# EasyEDA Pro project PCBLayout.epro

# Board PCB1
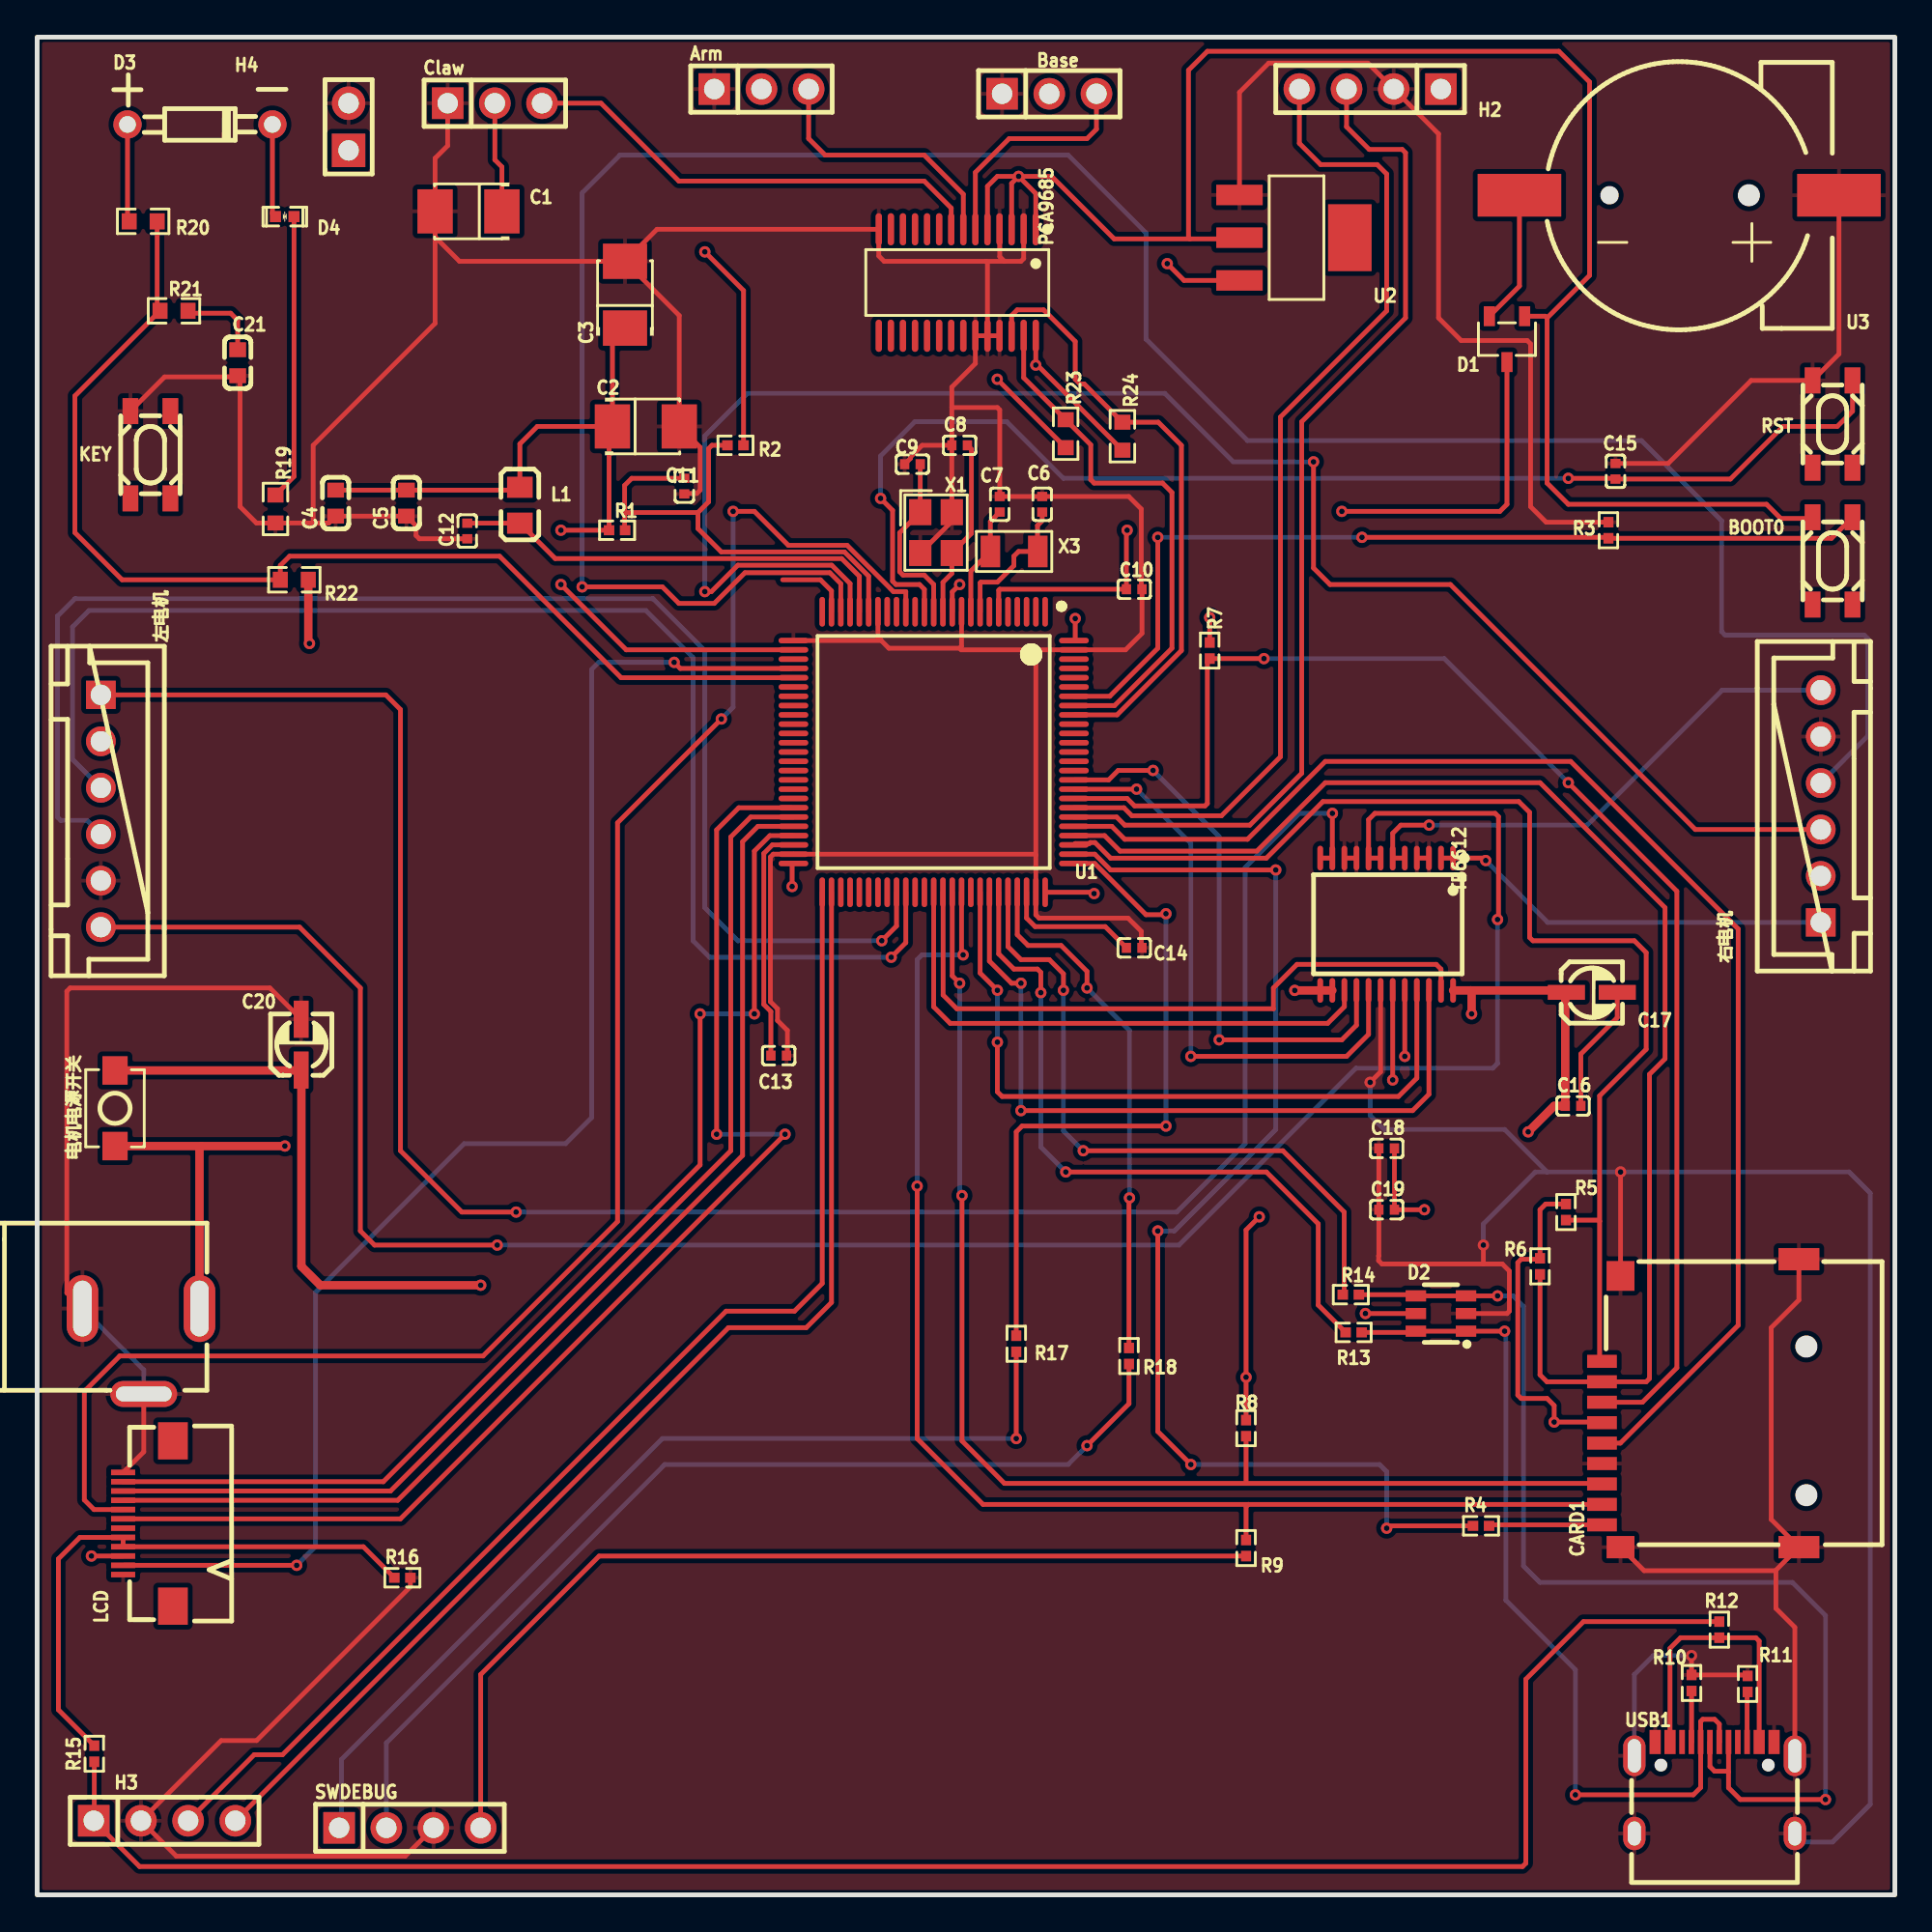
[diagram p0: board, top side]
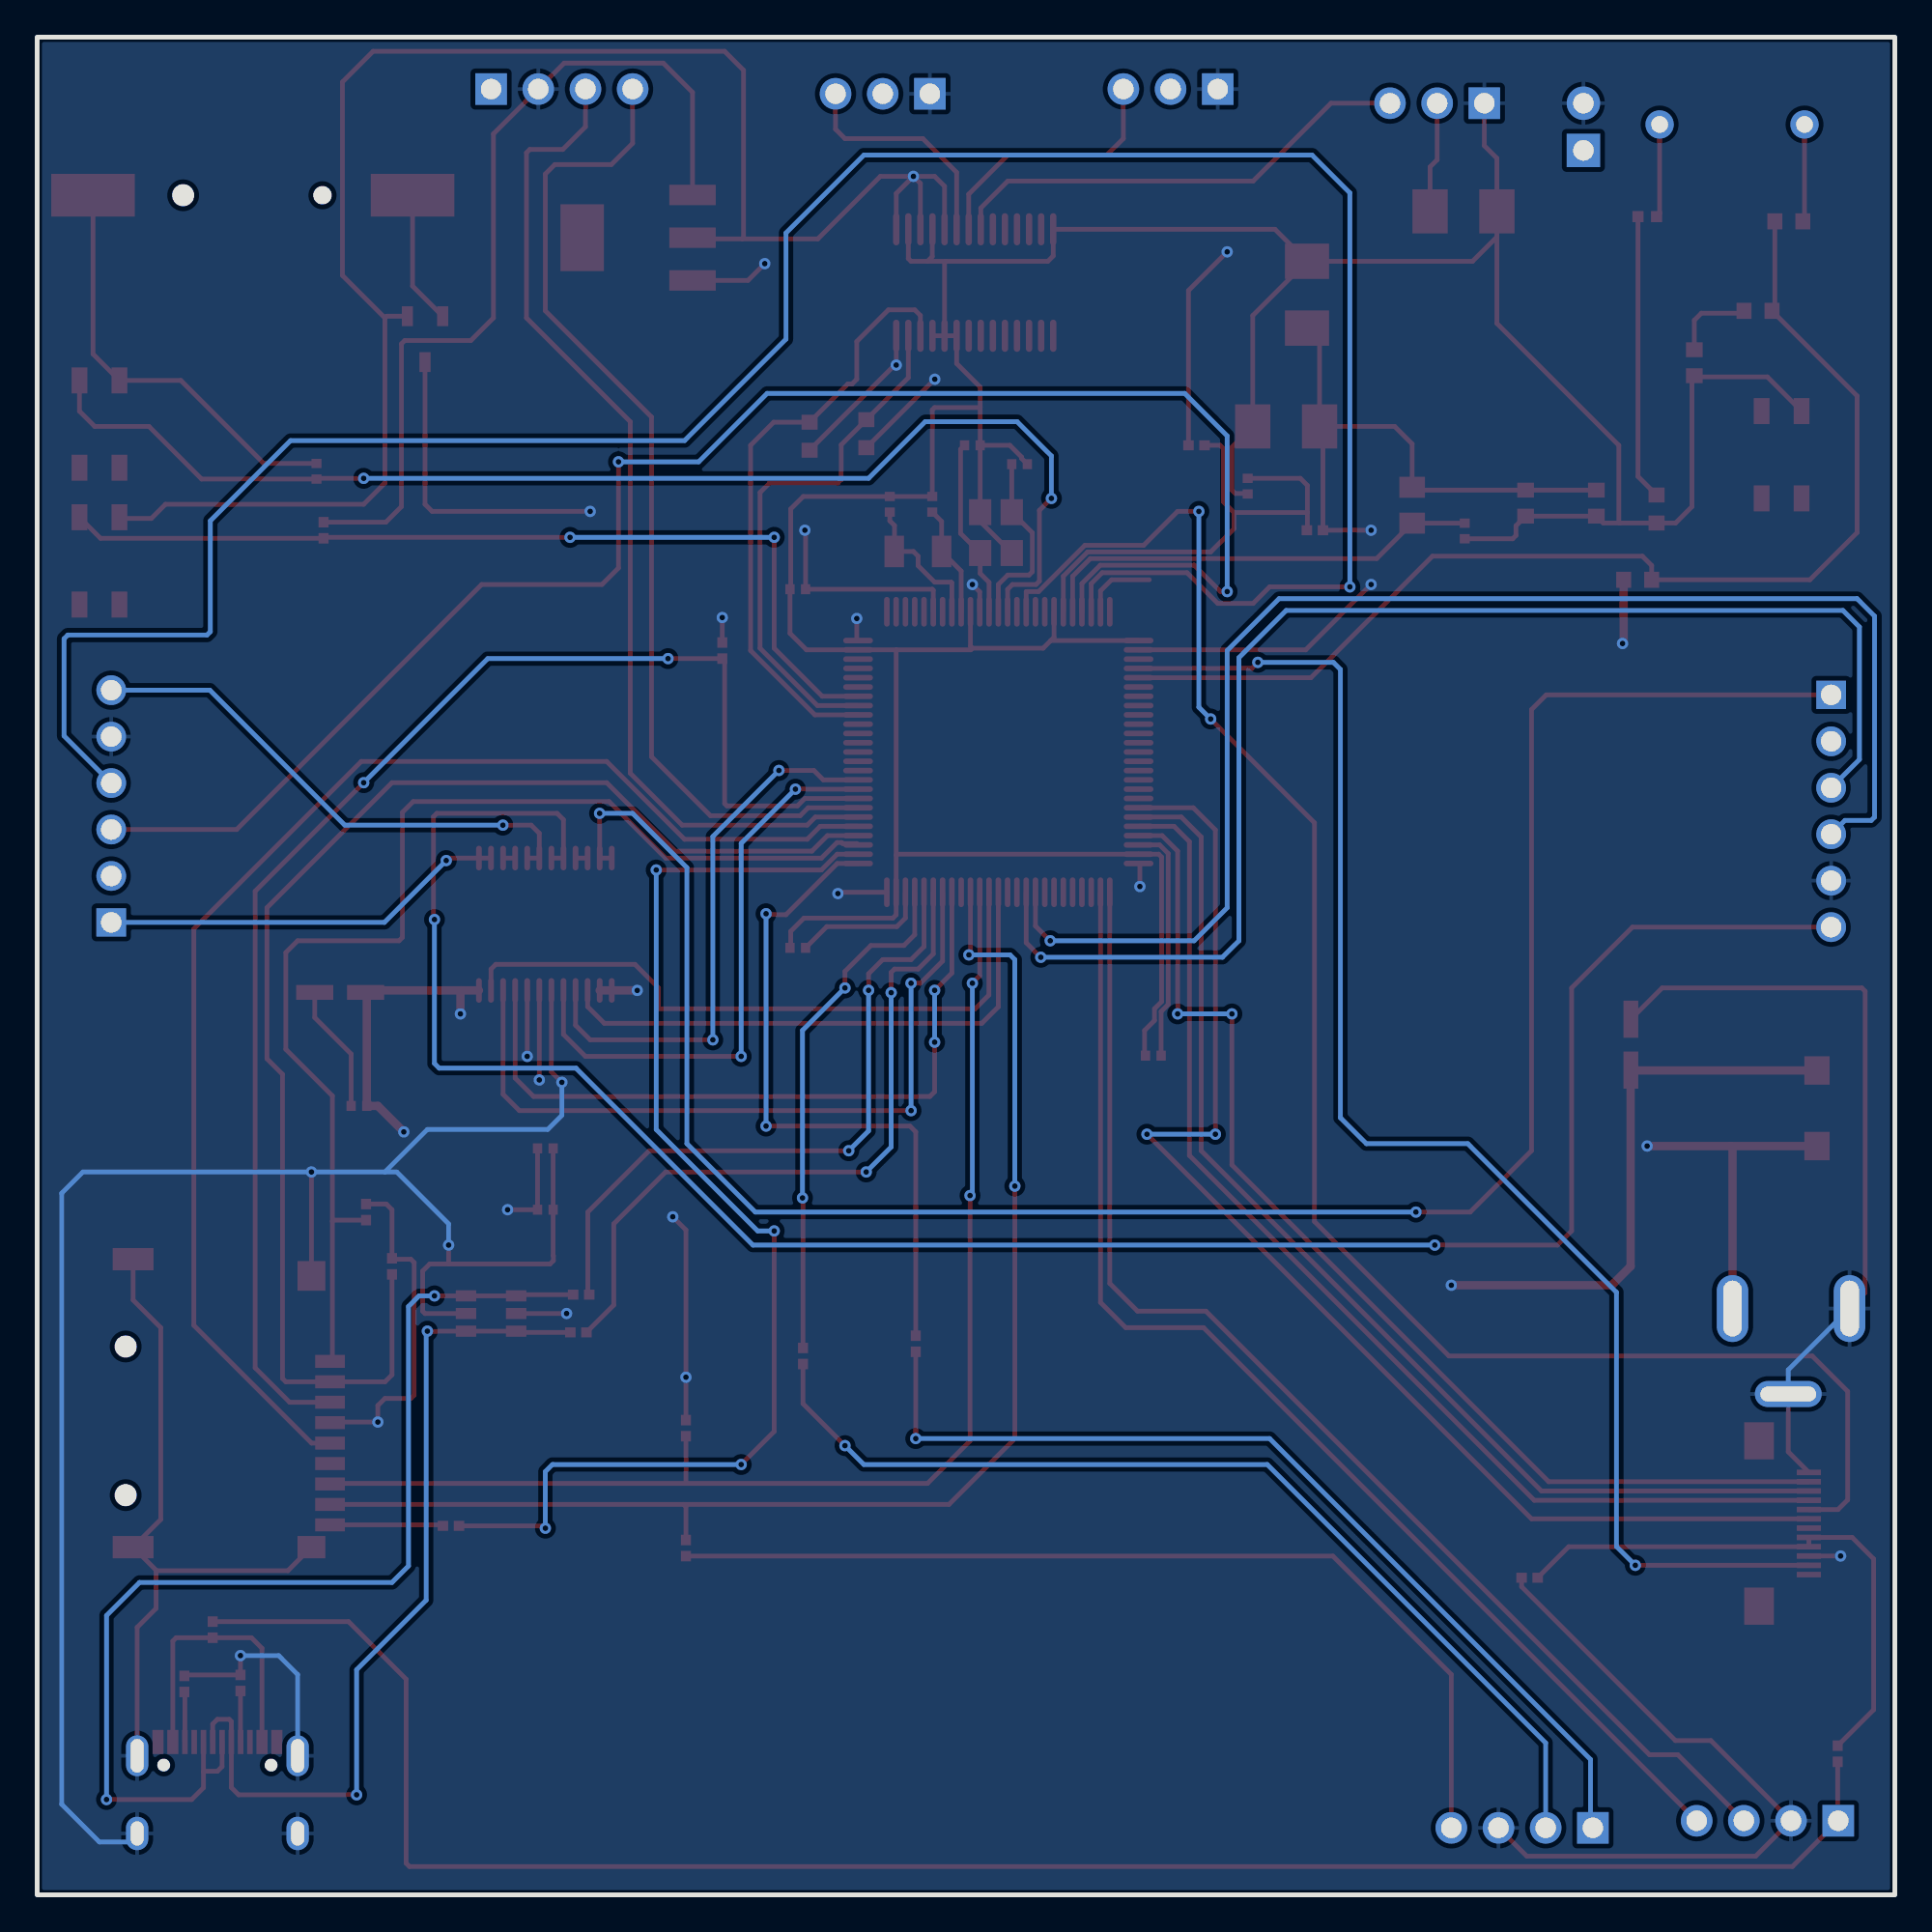
[diagram p1: board, bottom side, seen from below]

Outline 100 x 100 mm; copper layers: Top Layer, Inner1, Inner2, Bottom Layer. Coordinates in mm from the lower left corner of the outline.
Outline path: rectangle 0,100 100,0
Stack: Top Layer 0.035mm 外层铜厚1oz / Dielectric1 0.2104mm 7628 RC49% 8.6mil / Inner1 0.0152mm 内层铜厚 / Dielectric2 1.065mm 1.1mm H/HOZ Copper / Inner2 0.0152mm 内层铜厚 / Dielectric3 0.2104mm 7628 RC49% 8.6mil / Bottom Layer 0.035mm 外层铜厚1oz

## Design rules (mm)
template: 自定义配置
spacing copperThickness1oz (default): track to track 0.102, other pairs 0.152 to 0.3
spacing copperThickness2oz: track to track 0.203, other pairs 0.152 to 0.3
track width copperThickness1oz (default): min 0.127, default 0.254, max 2.54
track width copperThickness2oz: min 0.203, default 0.254, max 2.54
differential pair differentialPair (default): width min 0.127, default 0.254, max 2.54; gap min 0.152, default 0.152
via viaSize (default): diameter min 0.5, default 0.61, max 10; hole min 0.3, default 0.305, max 6.3

## Placement (name value [footprint] x y rotation side)
Arm  -  [HDR-TH_3P-P2.54-V-M]  38.99 97.21 0 top
Base  -  [HDR-TH_3P-P2.54-V-M]  54.48 96.95 0 top
BOOT0  TS-1145A-B-A  [SW-SMD_4P-L4.2-W3.2-P2.15-LS5.2]  96.65 71.81 0 top
C1  100uF  [CAP-SMD_L3.5-W2.8-FD]  23.22 90.62 180 top
C2  100uF  [CAP-SMD_L3.5-W2.8-FD]  32.77 79.05 0 top
C3  10uF  [CAP-SMD_L3.5-W2.8-FD]  31.64 86.14 90 top
C4  100nF  [C0603]  16.07 74.92 90 top
C5  100nF  [C0603]  19.88 74.92 90 top
C6  5pF  [C0402]  54.1 74.85 90 top
C7  5pF  [C0402]  51.82 74.85 90 top
C8  10pF  [C0402]  49.66 78.03 0 top
C9  10pF  [C0402]  47.12 77.01 180 top
C10  100nF  [C0402]  59.06 70.28 180 top
C11  100nF  [C0402]  34.84 75.83 90 top
C12  100nF  [C0402]  23.15 73.42 90 top
C13  2.2u  [C0402]  39.92 45.17 180 top
C14  2.2u  [C0402]  59.06 50.98 180 top
C15  100nF  [C0402]  84.96 76.63 270 top
C16  100nF  [C0402]  82.68 42.47 0 top
C17  10uF  [C_Ele_SMD_3x5.4mm]  83.69 48.56 180 top
C18  100nF  [C0402]  72.64 40.18 0 top
C19  100nF  [C0402]  72.64 36.88 0 top
C20  220uF  [C_Ele_SMD_3x5.4mm]  14.22 45.77 270 top
C21  100nF  [C0603]  10.8 82.47 270 top
CARD1  XKTF-015-N  [TF-SMD_XKTF-015-N]  89.53 26.47 90 top
Claw  -  [HDR-TH_3P-P2.54-V-M]  24.64 96.44 0 top
D1  BAT54C,215  [SOT-23-3_L2.9-W1.6-P1.90-LS2.8-BR]  79.12 83.74 90 top
D2  BST236A054U  [SOT-23-6_L2.9-W1.6-P0.95-LS2.8-BR]  75.56 31.29 0 top
D3  BAT85S-TR  [DO-35_BD1.7-L3.8-P7.8-D0.5-FD]  8.76 95.3 0 top
D4  PESD0402-30  [D0402-BI]  13.33 90.34 180 top
H2  OpenMV  [HDR-TH_4P-P2.54-V-M]  71.75 97.21 180 top
H3  BT24  [HDR-TH_4P-P2.54-V-M]  6.86 3.99 0 top
H4  -  [HDR-TH_2P-P2.54-V-M-1]  16.76 95.17 90 top
KEY  TS-1145A-B-A  [SW-SMD_4P-L4.2-W3.2-P2.15-LS5.2]  6.1 77.52 0 top
L1  0.1uH  [L0805]  25.98 74.8 270 top
LCD  TFT-LCD  [FPC-SMD_AFC01-S12FCA-00]  5.97 19.99 90 top
PCA9685  PCA9685PW/Q900,118  [TSSOP-28_L9.7-W4.4-P0.65-LS6.4-BL]  49.53 86.79 180 top
R1  10  [R0402]  31.22 73.46 180 top
R2  0  [R0402]  37.59 78.03 0 top
R3  1K  [R0402]  84.58 73.46 90 top
R4  10K  [R0402]  77.72 19.86 0 top
R5  10K  [R0402]  82.3 36.75 270 top
R6  10K  [R0402]  80.9 33.83 270 top
R7  10K  [R0402]  63.12 66.98 270 top
R8  10K  [R0402]  65.08 25.12 270 top
R9  10K  [R0402]  65.08 18.67 90 top
R10  5.1K  [R0402]  89.06 11.41 90 top
R11  5.1K  [R0402]  92.07 11.35 90 top
R12  12  [R0402]  90.55 14.28 90 top
R13  0  [R0402]  70.87 30.28 180 top
R14  0  [R0402]  70.72 32.31 180 top
R15  4.4K  [R0402]  3.08 7.6 90 top
R16  5.6K  [R0402]  19.66 17.07 0 top
R17  10K  [R0402]  52.71 29.67 270 top
R18  10K  [R0402]  58.77 29.01 270 top
R19  10K  [R0603]  12.83 74.6 270 top
R20  100  [R0603]  5.71 90.09 180 top
R21  1K  [R0603]  7.37 85.27 0 top
R22  27K  [R0603]  13.84 70.79 180 top
R23  2.2K  [R0603]  55.36 78.66 270 top
R24  2.2K  [R0603]  58.42 78.52 270 top
RST  TS-1145A-B-A  [SW-SMD_4P-L4.2-W3.2-P2.15-LS5.2]  96.65 79.17 0 top
SWDEBUG  PZ254V-11-04P  [HDR-TH_4P-P2.54-V-M]  20.07 3.61 0 top
TB6612  TB6612FNG,C,8,EL  [SSOP-24_L8.3-W5.6-P0.65-LS7.6-BL]  72.64 52.25 180 top
U1  STM32H750VBT6  [LQFP-100_L14.0-W14.0-P0.50-LS16.0-BL]  48.26 61.52 180 top
U2  AMS1117-3.3  [SOT-223-3_L6.5-W3.4-P2.30-LS7.0-BR]  67.69 89.2 180 top
U3  XDCR-1220-006  [BAT-SMD_CR1220-2ZX]  88.39 91.49 180 top
U8  DC-12V  [DC-IN-TH_DC005-2.5MM]  5.59 29.26 0 top
USB1  U262-161N-4BVC11  [USB-3.1-SMD_U262-161N-4BVC11]  90.3 5.77 0 top
X1  25MHz  [CRYSTAL-SMD_4P-L3.2-W2.5-BL]  48.39 73.33 270 top
X3  32.768kHz  [CRYSTAL-SMD_L3.2-W1.5-1]  52.59 72.31 0 top
右电机  motor_左B  [CONN-TH_6P-P2.50_ZX-XH2.54-6PZZ]  96.01 58.6 90 top
左电机  motor_右A  [CONN-TH_6P-P2.50_ZX-XH2.54-6PZZ]  3.43 58.34 270 top
电机电源开关  -  [Key_SMD_3x4x2]  4.19 42.34 90 top

## Footprints (pads in the part's own frame, mm; a bottom-side part is the same pattern mirrored in y, then rotated)
BAT-SMD_CR1220-2ZX
  rect 4.5x2.3 smd: 1(-8.6,0) 2(8.6,0)
C0402
  rect 0.5x0.54 smd: 1(-0.42,0) 2(0.42,0)
C0603
  rect 0.8x0.9 smd: 1(-0.7,0) 2(0.7,0)
C_Ele_SMD_3x5.4mm
  rect 1.999x0.8 smd: 1(1.374,-0.014) 2(-1.364,-0.014)
CAP-SMD_L3.5-W2.8-FD
  rect 1.9x2.376 smd: 1(-1.798,0) 2(1.798,0)
CONN-TH_6P-P2.50_ZX-XH2.54-6PZZ
  rect 1.524x1.6 hole 1.1: 1(-6.25,0)
  round 1.6 hole 1.1: 2(-3.75,0) 3(-1.25,0) 4(1.25,0) 5(3.75,0) 6(6.25,0)
CRYSTAL-SMD_4P-L3.2-W2.5-BL
  rect 1.4x1.2 smd: 1(-1.1,-0.85) 2(1.1,-0.85) 3(1.1,0.85) 4(-1.1,0.85)
CRYSTAL-SMD_L3.2-W1.5-1
  rect 1.05x1.7 smd: 1(-1.275,0) 2(1.275,0)
D0402-BI
  rect 0.6x0.6 smd: 1(-0.5,0) 2(0.5,0)
DC-IN-TH_DC005-2.5MM
  oval 3.6x1.4 hole 3x0.8: 2(0.15,-2.3)
  oval 1.7x3.6 hole 1x3: 3(-3.15,2.3) 4(3.15,2.3)
DO-35_BD1.7-L3.8-P7.8-D0.5-FD
  round 1.524 hole 0.9: 1(3.9,0) 2(-3.9,0)
FPC-SMD_AFC01-S12FCA-00
  rect 0.3x1.3 smd: 1(-2.751,1.341) 2(-2.251,1.341) 3(-1.751,1.341) 4(-1.25,1.341) 5(-0.75,1.341) 6(-0.249,1.341) 7(0.251,1.341) 8(0.75,1.341) 9(1.249,1.341) 10(1.75,1.341) 11(2.249,1.341) 12(2.75,1.341)
  rect 2x1.6 smd: 13(-4.45,-1.34) 14(4.45,-1.341)
HDR-TH_2P-P2.54-V-M-1
  rect 1.8x1.8 hole 1.1: 1(-1.27,0)
  round 1.8 hole 1.1: 2(1.27,0)
HDR-TH_3P-P2.54-V-M
  rect 1.7x1.7 hole 1.1: 1(-2.54,0)
  round 1.7 hole 1.1: 2(0,0) 3(2.54,0)
HDR-TH_4P-P2.54-V-M
  rect 1.7x1.7 hole 1.1: 1(-3.81,0)
  round 1.7 hole 1.1: 2(-1.27,0) 3(1.27,0) 4(3.81,0)
Key_SMD_3x4x2
  rect 1.53x1.36 smd: 1(-2.035,0) 2(2.035,0)
L0805
  rect 1.133x1.377 smd: 1(-0.966,0) 2(0.966,0)
LQFP-100_L14.0-W14.0-P0.50-LS16.0-BL
  oval 0.3x1.6 smd: 1(-6,-7.55) 2(-5.5,-7.55) 3(-5,-7.55) 4(-4.5,-7.55) 5(-4,-7.55) 6(-3.5,-7.55) 7(-3,-7.55) 8(-2.5,-7.55) 9(-2,-7.55) 10(-1.5,-7.55) 11(-1,-7.55) 12(-0.5,-7.55) 13(0,-7.55) 14(0.5,-7.55) 15(1,-7.55) 16(1.5,-7.55) 17(2,-7.55) 18(2.5,-7.55) 19(3,-7.55) 20(3.5,-7.55) 21(4,-7.55) 22(4.5,-7.55) 23(5,-7.55) 24(5.5,-7.55) 25(6,-7.55) 51(6,7.55) 52(5.5,7.55) 53(5,7.55) 54(4.5,7.55) 55(4,7.55) 56(3.5,7.55) 57(3,7.55) 58(2.5,7.55) 59(2,7.55) 60(1.5,7.55) 61(1,7.55) 62(0.5,7.55) 63(0,7.55) 64(-0.5,7.55) 65(-1,7.55) 66(-1.5,7.55) 67(-2,7.55) 68(-2.5,7.55) 69(-3,7.55) 70(-3.5,7.55) 71(-4,7.55) 72(-4.5,7.55) 73(-5,7.55) 74(-5.5,7.55) 75(-6,7.55)
  oval 1.6x0.3 smd: 26(7.55,-6) 27(7.55,-5.5) 28(7.55,-5) 29(7.55,-4.5) 30(7.55,-4) 31(7.55,-3.5) 32(7.55,-3) 33(7.55,-2.5) 34(7.55,-2) 35(7.55,-1.5) 36(7.55,-1) 37(7.55,-0.5) 38(7.55,0) 39(7.55,0.5) 40(7.55,1) 41(7.55,1.5) 42(7.55,2) 43(7.55,2.5) 44(7.55,3) 45(7.55,3.5) 46(7.55,4) 47(7.55,4.5) 48(7.55,5) 49(7.55,5.5) 50(7.55,6) 76(-7.55,6) 77(-7.55,5.5) 78(-7.55,5) 79(-7.55,4.5) 80(-7.55,4) 81(-7.55,3.5) 82(-7.55,3) 83(-7.55,2.5) 84(-7.55,2) 85(-7.55,1.5) 86(-7.55,1) 87(-7.55,0.5) 88(-7.55,0) 89(-7.55,-0.5) 90(-7.55,-1) 91(-7.55,-1.5) 92(-7.55,-2) 93(-7.55,-2.5) 94(-7.55,-3) 95(-7.55,-3.5) 96(-7.55,-4) 97(-7.55,-4.5) 98(-7.55,-5) 99(-7.55,-5.5) 100(-7.55,-6)
R0402
  rect 0.566x0.54 smd: 1(-0.433,0) 2(0.433,0)
R0603
  rect 0.806x0.864 smd: 1(-0.753,0) 2(0.753,0)
SOT-23-3_L2.9-W1.6-P1.90-LS2.8-BR
  rect 1.07x0.6 smd: 1(1.235,-0.95) 2(1.235,0.95) 3(-1.235,0)
SOT-23-6_L2.9-W1.6-P0.95-LS2.8-BR
  rect 1.1x0.6 smd: 1(1.35,-0.95) 2(1.35,0) 3(1.35,0.95) 4(-1.35,0.95) 5(-1.35,0) 6(-1.35,-0.95)
SOT-223-3_L6.5-W3.4-P2.30-LS7.0-BR
  rect 2.5x1.1 smd: 1(2.97,-2.3) 2(2.97,0) 3(2.97,2.3)
  rect 2.34x3.6 smd: 4(-2.97,0)
SSOP-24_L8.3-W5.6-P0.65-LS7.6-BL
  oval 0.308x1.324 smd: 1(-3.575,-3.562) 2(-2.925,-3.562) 3(-2.275,-3.562) 4(-1.625,-3.562) 5(-0.975,-3.562) 6(-0.325,-3.562) 7(0.325,-3.562) 8(0.975,-3.562) 9(1.625,-3.562) 10(2.275,-3.562) 11(2.925,-3.562) 12(3.575,-3.562) 13(3.575,3.562) 14(2.925,3.562) 15(2.275,3.562) 16(1.625,3.562) 17(0.975,3.562) 18(0.325,3.562) 19(-0.325,3.562) 20(-0.975,3.562) 21(-1.625,3.562) 22(-2.275,3.562) 23(-2.925,3.562) 24(-3.575,3.562)
SW-SMD_4P-L4.2-W3.2-P2.15-LS5.2
  rect 0.85x1.4 smd: 1(1.075,2.35) 2(1.075,-2.35) 3(-1.075,2.35) 4(-1.075,-2.35)
TF-SMD_XKTF-015-N
  rect 0.7x1.6 smd: 1(2.25,5.3) 2(1.15,5.3) 3(0.05,5.3) 4(-1.05,5.3) 5(-2.15,5.3) 6(-3.25,5.3) 7(-4.35,5.3) 8(-5.45,5.3) 9(-6.55,5.3)
  rect 1.2x1.5 smd: 10(-7.75,4.3)
  rect 1.2x2.2 smd: 11(-7.75,-5.3) 13(7.75,-5.3)
  rect 1.6x1.5 smd: 12(6.85,4.3)
TSSOP-28_L9.7-W4.4-P0.65-LS6.4-BL
  oval 0.343x1.732 smd: 1(-4.225,-2.866) 2(-3.575,-2.866) 3(-2.925,-2.866) 4(-2.275,-2.866) 5(-1.625,-2.866) 6(-0.975,-2.866) 7(-0.325,-2.866) 8(0.325,-2.866) 9(0.975,-2.866) 10(1.625,-2.866) 11(2.275,-2.866) 12(2.925,-2.866) 13(3.575,-2.866) 14(4.225,-2.866) 15(4.225,2.866) 16(3.575,2.866) 17(2.925,2.866) 18(2.275,2.866) 19(1.625,2.866) 20(0.975,2.866) 21(0.325,2.866) 22(-0.325,2.866) 23(-0.975,2.866) 24(-1.625,2.866) 25(-2.275,2.866) 26(-2.925,2.866) 27(-3.575,2.866) 28(-4.225,2.866)
USB-3.1-SMD_U262-161N-4BVC11
  oval 1.2x2.2 hole 0.7x1.8: 13(4.32,1.719) 16(-4.32,1.719)
  oval 1.2x1.8 hole 0.7x1.3: 14(4.32,-2.462) 15(-4.32,-2.462)
  rect 0.6x1.3 smd: A1B12(-3.2,2.462) A4B9(-2.4,2.462) B1A12(3.2,2.462) B4A9(2.4,2.462)
  rect 0.3x1.3 smd: A5(-1.25,2.462) A6(-0.25,2.462) A7(0.25,2.462) A8(1.25,2.462) B5(1.75,2.462) B6(0.75,2.462) B7(-0.75,2.462) B8(-1.75,2.462)

## Nets
2.8V: LCD.4 LCD.5 R15.2 R16.1
5V: Arm.2 Base.2 C1.1 C18.2 C19.2 Claw.2 H2.1 H3.1 R12.2 R15.1 TB6612.19 U2.3 右电机.2 左电机.2
12VIN: C16.1 C17.1 C20.1 TB6612.13 TB6612.14 TB6612.24 电机电源开关.2
GND: Arm.1 Base.1 C1.2 C2.2 C3.2 C4.1 C5.1 C6.2 C7.2 C8.1 C9.2 C10.1 C11.1 C12.1 C13.1 C14.1 C15.1 C18.1 C19.1 C20.2 C21.2 CARD1.6 CARD1.10 CARD1.11 CARD1.12 CARD1.13 Claw.1 D2.2 H2.2 H3.2 H4.2 KEY.3 LCD.1 LCD.12 PCA9685.2 PCA9685.4 PCA9685.14 PCA9685.23 PCA9685.24 PCA9685.25 R3.2 R10.2 R11.2 R16.2 R19.2 RST.3 SWDEBUG.3 TB6612.3 TB6612.4 TB6612.9 TB6612.10 TB6612.18 U1.10 U1.19 U1.26 U1.49 U1.74 U1.99 U2.1 U3.1 U8.2 U8.3 USB1.13 USB1.14 USB1.15 USB1.16 USB1.A1B12 USB1.B1A12 X1.2 X1.4 右电机.5 左电机.5
VBAT: C10.2 D1.3 U1.6
VBUS: R12.1 USB1.A4B9 USB1.B4A9
VCC: BOOT0.3 C2.1 C3.1 C4.2 C5.2 CARD1.4 D1.1 D2.5 L1.1 LCD.3 PCA9685.1 PCA9685.3 PCA9685.5 PCA9685.28 R1.2 R5.1 R6.1 R7.1 R8.1 R9.1 R23.2 R24.2 SWDEBUG.4 TB6612.20 U1.11 U1.27 U1.50 U1.75 U1.100 U2.2
VDDA: C12.2 L1.2 U1.21
VIN: R22.1 U8.4 电机电源开关.1
ADC_IN: R20.1 R21.1 R22.2 U1.30
AIN1: TB6612.21 U1.68
AIN2: TB6612.22 U1.69
AO1: TB6612.1 TB6612.2 右电机.1
AO2: TB6612.5 TB6612.6 右电机.6
ARM: Arm.3 PCA9685.7
BASE: Base.3 PCA9685.6
BIN1: TB6612.17 U1.84
BIN2: TB6612.16 U1.85
BO1: TB6612.11 TB6612.12 左电机.1
BO2: TB6612.7 TB6612.8 左电机.6
BOOT0: BOOT0.1 R3.1 U1.94
CLAW: Claw.3 PCA9685.8
EX_LA: U1.22 右电机.3
EX_LB: U1.23 右电机.4
EX_RA: U1.60 左电机.3
EX_RB: U1.59 左电机.4
I2C4_SCL: PCA9685.26 R24.1 U1.92
I2C4_SDA: PCA9685.27 R23.1 U1.93
KEY: KEY.1
LCD_BLK: LCD.2 U1.29
LCD_CS: LCD.11 U1.47
LCD_RS: LCD.10 U1.45
LCD_RST: LCD.7 U1.44
LCD_SCL: LCD.9 U1.46
LCD_SDA: LCD.8 U1.16
M-PWMA: TB6612.23 U1.64
M-PWMB: TB6612.15 U1.63
NRST: C15.2 RST.1 U1.14
OSC32_IN: C6.1 U1.8 X3.2
OSC32_OUT: C7.1 U1.9 X3.1
OSC_IN: C8.2 U1.12 X1.3
OSC_OUT: C9.1 U1.13 X1.1
SDMMC-CD: R4.1 U1.77
SDMMC-CLK: CARD1.5 U1.80
SDMMC-CMD: CARD1.3 R7.2 U1.83
SDMMC-D0: CARD1.7 R8.2 U1.65
SDMMC-D1: CARD1.8 R9.2 U1.66
SDMMC-D2: CARD1.1 R5.2 U1.78
SDMMC-D3: CARD1.2 R6.2 U1.79
STATUS_BLE: U1.24
SWCLK: R17.1 U1.76
SWDIO: R18.1 U1.72
UART4_RX: H2.3 U1.81
UART4_TX: H2.4 U1.82
UART5_RX: H3.3 U1.51
UART5_TX: H3.4 U1.52
USB-DN: R13.2 U1.70
USB-DP: R14.2 U1.71
USBC-CC1: R10.1 USB1.A5
USBC-CC2: R11.1 USB1.B5
USBC-DN: D2.1 D2.6 R13.1 USB1.A7 USB1.B7
USBC-DP: D2.3 D2.4 R14.1 USB1.A6 USB1.B6
VCAP1: C13.2 U1.48
VCAP2: C14.2 U1.73
VREF: C11.2 R1.1 R2.1 U1.20
VREF-C: H4.1 R2.2
$1N2673: D1.2 U3.2
$1N4458: CARD1.9 R4.2
$1N6086: C16.2 C17.2
$1N7839: R17.2 SWDEBUG.1
$1N7848: R18.2 SWDEBUG.2
$1N9792: D4.1 R19.1
$1N9800: D3.1 D4.2
$1N9955: D3.2 R20.2
$1N9971: C21.1 R21.2

Pads without a net: BOOT0 2 4; KEY 2 4; LCD 6 13 14; PCA9685 9 10 11 12 13 15 16 17 18 19 20 21 22; RST 2 4; U1 1 2 3 4 5 7 15 17 18 25 28 31 32 33 34 35 36 37 38 39 40 41 42 43 53 54 55 56 57 58 61 62 67 86 87 88 89 90 91 95 96 97 98; U2 4; USB1 A8 B8

## Via types
v1: diameter 0.61, hole 0.305, Top Layer to Bottom Layer, 87 vias

## Routing (per net, layer and track width the routed paths; a pad name or vN(x,y) marks a point on that pad's centre or on a via; arc(x,y) is an arc through that point)
2.8V: length 30.6
  Top Layer w0.254: R16.1 17.56,18.74 LCD.4 LCD.5 2.3,19.24 1.14,18.09 1.14,9.96 R15.2
5V: length 409.9
  Top Layer w0.254: U2.3 61.74,86.91 v1(60.83,87.81) ; Claw.2 24.64,93.4 25.02,93.02 C1.1 ; v1(74.68,36.88) C19.2 C18.2 ; TB6612.19 v1(72.97,43.87) ; R15.1 3.08,4.02 H3.1 5.51,1.52 79.96,1.52 80.14,1.7 80.14,11.61 83.24,14.71 R12.2
  Inner2 w0.254: 右电机.2 83.99,54.85 83.75,55.09 ; 27.43,99.24 37.45,99.24 ; 27.43,99.24 Claw.2 ; 27.43,99.24 16.26,99.24 14.99,97.97 14.99,83.36 10.29,78.66 10.29,68.95 ; 37.45,99.24 52.93,99.24 ; 37.45,99.24 38.99,97.7 Arm.2 ; H2.1 73.53,99.24 58.33,99.24 ; 83.75,55.09 78.23,49.58 78.23,47.42 76.4,45.59 76.4,43.87 ; 83.75,55.09 83.75,61.72 83.57,61.9 75.31,61.9 72.26,64.95 72.26,74.85 60.83,86.28 v1(60.83,87.81) 60.83,96.73 58.33,99.24 ; v1(74.68,36.88) 76.4,38.61 76.4,43.87 ; v1(72.97,43.87) 76.4,43.87 76.4,43.87 ; 10.29,68.95 10.29,38.15 12.06,36.37 12.06,29.52 11.56,29.01 2.54,29.01 0.89,27.36 0.89,4.5 1.4,3.99 H3.1 ; 10.29,68.95 左电机.2 ; 58.33,99.24 52.93,99.24 ; Base.2 54.48,97.68 52.93,99.24
12VIN: length 120.2
  Top Layer w0.45: 77.17,48.69 77.22,48.64 v1(77.22,47.42) ; 77.17,48.69 82.21,48.69 C17.1 82.26,48.52 C16.1 81.66,42.47 v1(80.26,41.07) ; 77.17,48.69 TB6612.24 ; v1(67.7,48.69) TB6612.13 TB6612.14 ; 电机电源开关.2 14.19,44.38 C20.1 14.22,44.38 14.22,33.83 15.24,32.82 v1(23.88,32.82)
  Inner2 w0.45: v1(77.22,47.42) 76.33,46.53 68.45,46.53 67.7,47.29 v1(67.7,48.69) ; v1(80.26,41.07) 72.77,33.58 24.64,33.58 v1(23.88,32.82)
GND: length 560.6
  Top Layer w0.254: Claw.1 22.1,94.16 21.42,93.48 C1.2 21.42,89.25 ; TB6612.9 TB6612.10 ; 77.84,33.96 78.87,33.96 79.25,33.58 79.25,31.42 79.12,31.29 D2.2 ; 77.84,33.96 72.39,33.96 72.21,34.14 72.21,34.39 72.22,34.41 72.22,40.18 ; 77.84,33.96 77.85,33.97 v1(77.85,34.98) ; C11.1 34.86,75.44 35.51,75.44 35.69,75.62 35.69,77.92 C2.2 34.56,85.01 C3.2 ; 53.76,55.97 53.71,56.02 39.62,56.02 39.47,55.87 39.47,48.08 39.85,47.7 39.85,47.07 40.39,46.53 40.39,45.22 C13.1 ; 53.76,55.97 53.76,67 53.75,67.02 ; 53.76,55.97 U1.74 53.76,52.76 53.94,52.58 58.73,52.58 59.44,51.87 59.44,51.02 C14.1 ; KEY.3 6.86,81.71 10.73,81.71 C21.2 10.92,81.65 10.92,74.73 11.8,73.85 R19.2 14.81,73.85 ; C8.1 49.24,80.1 ; C8.1 49.24,73.93 X1.2 ; C8.1 47.64,78.03 47.01,77.4 47.01,77.32 C9.2 ; 49.24,80.1 49.27,80.06 51.69,80.06 51.82,79.93 C7.2 C6.2 58.76,75.27 59.44,74.6 59.44,70.32 C10.1 59.47,67.91 58.59,67.02 U1.99 53.75,67.02 ; 49.24,80.1 49.24,81.17 50.5,82.43 PCA9685.23 PCA9685.24 ; R3.2 81.23,73.89 80.39,74.73 80.39,83.49 80.21,83.67 76.66,83.67 75.44,84.89 75.44,94.79 H2.2 71.63,98.6 66.29,98.6 64.72,97.03 U2.1 ; C15.1 87.8,77.05 92.27,81.52 95.57,81.52 96.99,82.94 U3.1 ; 53.75,67.02 49.75,67.02 49.66,67.11 ; 49.66,67.11 45.85,67.11 45.44,67.52 ; 49.66,67.11 49.76,67.21 U1.10 ; CARD1.10 86.5,17.45 93.57,17.45 ; PCA9685.2 53.1,88.08 52.96,87.94 52.07,87.94 ; 93.57,17.45 93.6,17.42 93.6,15.42 94.62,14.4 USB1.13 ; 93.57,17.45 CARD1.11 93.34,20.21 93.34,30.53 94.84,32.02 CARD1.13 ; 40.71,67.52 45.44,67.52 ; 45.44,67.52 45.26,67.69 U1.19 ; 2.44,31.56 1.6,32.4 1.6,48.64 1.78,48.82 12.53,48.82 C20.2 ; PCA9685.24 51.16,87.86 51.08,87.94 ; PCA9685.24 PCA9685.25 ; 14.81,73.85 14.86,73.89 14.86,78.03 21.42,84.59 21.42,89.25 ; 14.81,73.85 15.7,73.85 C4.1 C5.1 20.39,73.7 20.39,73.18 20.57,73 C12.1 ; 51.08,87.94 45.59,87.94 45.31,88.22 PCA9685.14 33.37,89.66 C3.2 ; 51.08,87.94 52.07,87.94 ; TB6612.18 72.32,44.3 v1(71.75,43.74) ; PCA9685.4 51.82,89.65 51.82,88.19 52.07,87.94 ; 21.42,89.25 22.73,87.94 C3.2 ; LCD.12 5.74,23.85 U8.2 ; R11.2 92.02,11.84 R10.2 v1(89.06,12.88) ; SWDEBUG.3 19.81,2.08 7.49,2.08 5.59,3.99 9.91,8.31 11.81,8.31 20.09,16.59 20.09,17.07 ; CARD1.12 v1(85.23,38.91) ; TB6612.4 TB6612.3
  Inner1 w0.254: 35.31,98.35 Arm.1 ; 35.31,98.35 50.55,98.35 Base.1 ; 35.31,98.35 24,98.35 Claw.1 H4.2
  Bottom Layer w0.254: v1(89.06,12.88) 87,12.88 85.98,11.86 USB1.16 ; USB1.14 95.08,2.84 96.65,2.84 98.68,4.88 98.68,37.77 97.54,38.91 v1(85.23,38.91) 81.28,38.91 ; 81.28,38.91 80.65,38.91 77.85,36.12 v1(77.85,34.98) ; 81.28,38.91 78.99,41.2 72.52,41.2 71.75,41.96 v1(71.75,43.74) ; U8.2 5.74,28.26 2.44,31.56
VBAT: length 40
  Top Layer w0.254: 58.63,70.41 58.63,73.42 v1(58.67,73.46) ; 58.63,70.41 C10.2 ; 58.63,70.41 58.51,70.28 51.82,70.28 51.76,70.23 U1.6 ; v1(70.23,74.47) 78.74,74.47 79.12,74.85 D1.3
  Inner2 w0.254: v1(58.67,73.46) 59.69,74.47 v1(70.23,74.47)
VBUS: length 15.6
  Top Layer w0.254: USB1.B4A9 92.7,13.66 92.52,13.84 R12.1 88.47,13.84 87.9,13.27 USB1.A4B9
VCC: length 542.9
  Top Layer w0.254: v1(28.19,70.54) 31.71,67.02 40.71,67.02 ; 62.05,89.14 64.66,89.14 U2.2 ; 62.05,89.14 57.98,89.14 54.61,92.51 v1(52.83,92.51) ; 62.05,89.14 61.98,89.21 61.98,98.22 62.99,99.24 81.91,99.24 83.57,97.59 83.57,87.17 81.28,84.89 ; R7.1 v1(63.12,68.76) ; C3.1 30.97,83.66 C2.1 ; 81.28,84.89 81.19,84.98 D1.1 ; 81.28,84.89 81.28,76 82.42,74.85 93.09,74.85 93.85,74.09 95.51,74.09 BOOT0.3 ; C2.1 26.92,79.05 25.98,78.11 L1.1 25.83,75.62 C5.2 C4.2 ; C2.1 30.79,78.86 30.79,73.46 v1(28.19,73.46) ; v1(56.9,53.9) 56.83,53.97 U1.75 ; D2.5 v1(71.5,31.29) ; SWDEBUG.4 23.88,11.86 30.25,18.24 R9.1 ; PCA9685.28 v1(53.75,82.35) 53.84,82.35 R24.2 ; v1(52.83,92.51) 52.46,92.13 PCA9685.3 ; v1(52.83,92.51) 53.75,91.58 PCA9685.1 ; v1(52.83,92.51) 51.69,92.51 51.16,91.97 PCA9685.5 ; TB6612.20 v1(73.62,45.14) ; 40.58,55.52 40.64,55.46 v1(40.64,54.28) ; U1.100 55.88,67.59 v1(55.88,68.7) ; LCD.3 v1(2.92,18.24) ; R23.2 v1(51.68,81.59) ; R5.1 81.21,37.19 80.9,36.88 R6.1 80.85,34.21 79.88,34.21 79.7,34.03 79.7,26.9 79.88,26.72 81.28,26.72 81.66,26.34 v1(81.66,25.45) 84.2,25.45 CARD1.4 ; v1(65.79,36.5) 65.08,35.79 v1(65.08,27.86) R8.1 ; U1.11 49.26,70.14 v1(49.66,70.54)
  Inner2 w0.254: 53.72,79.17 53.72,81.57 ; 53.72,79.17 53.72,77.51 ; 53.72,79.17 45.09,79.17 42.93,77.01 31.75,77.01 v1(28.19,73.46) v1(28.19,70.54) 28.19,48.82 33.4,43.61 43.12,43.61 44.82,45.31 ; 53.72,81.57 53.72,82.31 v1(53.75,82.35) 55.37,83.96 55.37,91.75 54.61,92.51 v1(52.83,92.51) ; 53.72,81.57 53.71,81.59 v1(51.68,81.59) ; 24,6.78 24,3.73 SWDEBUG.4 ; 24,6.78 6.22,6.78 2.92,10.08 v1(2.92,18.24) ; 24,6.78 25.15,7.93 25.15,17.2 35.81,27.86 v1(65.08,27.86) 68.09,27.86 68.19,27.96 ; v1(81.66,25.45) 70.36,25.45 68.19,27.62 68.19,27.96 ; 44.82,45.31 42.37,45.31 40.64,47.04 v1(40.64,54.28) ; 44.82,45.31 51.93,45.31 51.97,45.36 57.39,45.36 ; 57.39,45.36 57.39,53.4 v1(56.9,53.9) ; 57.39,45.36 57.39,43.6 57.45,43.55 67.75,43.55 ; 68.19,27.96 68.19,30.9 68.58,31.29 v1(71.5,31.29) ; v1(73.62,45.14) 69.34,45.14 67.75,43.55 ; 67.75,43.55 67.75,38.47 v1(65.79,36.5) ; 53.72,77.51 52.06,77.51 50.29,75.74 50.29,71.17 v1(49.66,70.54) ; 53.72,77.51 53.99,77.51 55.88,75.62 v1(55.88,68.7) 63.07,68.7 v1(63.12,68.76)
VDDA: length 24.2
  Top Layer w0.254: U1.21 44.26,70.98 43.31,71.93 27.89,71.93 L1.2 C12.2
VIN: length 60.4
  Top Layer w0.45: 8.84,40.31 13.33,40.31 v1(13.33,40.31) ; 8.84,40.31 电机电源开关.1 ; 8.84,40.31 8.74,40.2 U8.4 ; R22.1 14.6,67.42 v1(14.66,67.36)
  Inner2 w0.45: v1(13.33,40.31) 19.05,40.31 20.83,42.09 20.83,66.22 20.51,66.54 15.48,66.54 v1(14.66,67.36)
ADC_IN: length 62.1
  Top Layer w0.254: 6.46,90.09 6.46,85.42 R21.1 2.03,80.69 2.03,73.33 4.57,70.79 R22.2 13.09,71.56 13.59,72.06 24.89,72.06 31.43,65.52 40.71,65.52
AIN1: length 38.8
  Top Layer w0.254: 74.27,48.56 74.27,43.97 73.28,42.98 51.94,42.98 51.69,43.23 v1(51.69,45.9) ; v1(51.69,48.69) 50.76,49.62 U1.68
  Bottom Layer w0.254: v1(51.69,48.69) v1(51.69,45.9)
AIN2: length 40.7
  Top Layer w0.254: TB6612.22 74.92,43.09 74.04,42.22 v1(52.96,42.22) ; v1(52.96,49.07) 52.45,49.07 51.26,50.26 U1.69
  Bottom Layer w0.254: v1(52.96,42.22) 52.96,49.07 v1(52.96,49.07)
AO1: length 21.9
  Top Layer w0.254: v1(77.98,55.68) 77.84,55.81 TB6612.1 TB6612.2
  Bottom Layer w0.254: 右电机.1 81.31,52.35 v1(77.98,55.68)
AO2: length 28.2
  Top Layer w0.254: TB6612.5 TB6612.6 72.97,57.14 73.41,57.58 v1(74.93,57.58)
  Bottom Layer w0.254: 右电机.6 90.71,64.85 83.44,57.58 v1(74.93,57.58)
ARM: length 14.1
  Top Layer w0.254: PCA9685.7 49.85,91.55 47.75,93.65 42.42,93.65 41.53,94.54 Arm.3
BASE: length 12.4
  Top Layer w0.254: PCA9685.6 50.5,92.72 52.32,94.54 56.51,94.54 57.02,95.05 Base.3
BIN1: length 31.4
  Top Layer w0.254: U1.84 v1(59.18,59.52) ; v1(62.1,45.14) 70.48,45.14 71.67,46.32 TB6612.17
  Bottom Layer w0.254: v1(59.18,59.52) 62.1,56.6 v1(62.1,45.14)
BIN2: length 30
  Top Layer w0.254: v1(63.63,46.03) 70.23,46.03 71.02,46.81 TB6612.16 ; v1(60.07,60.53) 58.19,60.53 57.68,60.02 U1.85
  Bottom Layer w0.254: v1(63.63,46.03) 63.63,56.97 v1(60.07,60.53)
BO1: length 112.4
  Top Layer w0.254: TB6612.12 TB6612.11 69.72,58.21 v1(69.72,58.22) ; 左电机.1 18.77,64.59 19.56,63.81 19.56,40.06 22.86,36.75 v1(25.78,36.75)
  Bottom Layer w0.254: v1(25.78,36.75) 61.34,36.75 65.02,40.44 65.02,55.3 67.94,58.22 v1(69.72,58.22)
BO2: length 117.2
  Top Layer w0.254: 左电机.6 14.12,52.09 17.4,48.82 17.4,35.74 18.16,34.98 v1(24.77,34.98) ; v1(78.61,52.5) 78.67,52.55 78.67,58.04 78.49,58.22 72.01,58.22 71.67,57.88 TB6612.8 TB6612.7
  Bottom Layer w0.254: v1(24.77,34.98) 61.47,34.98 70.99,44.5 78.36,44.5 78.61,44.75 v1(78.61,52.5)
BOOT0: length 49.3
  Top Layer w0.254: 97.72,74.16 96.59,73.02 R3.1 ; U1.94 57.74,64.52 60.32,67.11 v1(60.32,73.08) ; v1(71.32,73.08) 84.4,73.08 ; 84.52,72.96 84.58,72.9
  Bottom Layer w0.254: v1(60.32,73.08) v1(71.32,73.08)
CLAW: length 25.5
  Top Layer w0.254: Claw.3 30.35,96.44 34.54,92.25 47.75,92.25 49.21,90.8 PCA9685.8
EX_LA: length 92.8
  Top Layer w0.254: v1(35.94,70.16) 36.3,70.16 37.72,71.58 42.77,71.58 43.76,70.59 U1.22 ; 右电机.3 89.26,57.35 76.07,70.54 69.6,70.54 68.71,71.42 v1(68.71,77.14)
  Bottom Layer w0.254: v1(35.94,70.16) 35.94,78.54 38.23,80.82 60.71,80.82 64.39,77.14 v1(68.71,77.14)
EX_LB: length 134.4
  Top Layer w0.254: U1.23 43.26,70.58 42.67,71.17 38.1,71.17 36.45,69.52 34.54,69.52 33.66,70.41 v1(29.34,70.41)
  Bottom Layer w0.254: v1(29.34,70.41) 29.34,91.62 31.37,93.65 55.5,93.65 59.69,89.46 59.69,83.74 65.15,78.28 86.36,78.28 90.68,73.97 90.68,68 90.86,67.82 98.35,67.82 98.55,67.61 98.55,62.39 右电机.4
EX_RA: length 74.2
  Top Layer w0.254: v1(45.97,50.47) 46.76,51.26 U1.60
  Bottom Layer w0.254: 左电机.3 1.91,61.12 1.91,68.25 2.79,69.14 32.77,69.14 35.31,66.6 35.31,51.36 36.19,50.47 v1(45.97,50.47)
EX_RB: length 77
  Top Layer w0.254: v1(45.47,51.36) 46.26,52.15 U1.59
  Bottom Layer w0.254: 左电机.4 2.69,57.84 1.27,57.84 1.09,58.02 1.09,68.83 2.03,69.77 33.15,69.77 35.94,66.98 35.94,53.14 37.72,51.36 v1(45.47,51.36)
I2C4_SCL: length 32.8
  Top Layer w0.254: U1.92 58.13,63.52 61.59,66.98 61.59,78.03 60.35,79.27 R24.1 56.36,81.33 56.13,81.33 55.88,81.59 55.88,83.62 54.18,85.32 52.76,85.32 52.46,85.02 PCA9685.26
I2C4_SDA: length 28.8
  Top Layer w0.254: PCA9685.27 53.1,81.67 R23.1 56.72,78.06 56.72,76.18 56.9,76 60.58,76 61.09,75.49 61.09,67.11 58,64.02 U1.93
LCD_BLK: length 78.4
  Top Layer w0.254: v1(34.29,66.34) 34.62,66.02 40.58,66.02 ; LCD.2 v1(13.97,17.74)
  Bottom Layer w0.254: v1(13.97,17.74) 14.99,18.75 14.99,32.44 22.99,40.44 28.45,40.44 29.84,41.83 29.84,65.96 30.23,66.34 v1(34.29,66.34)
LCD_CS: length 60.4
  Top Layer w0.254: LCD.11 18.63,22.24 35.69,39.29 v1(35.69,47.42) ; 40.71,57.02 39.44,57.02 38.61,56.19 v1(38.61,47.42)
  Bottom Layer w0.254: v1(35.69,47.42) v1(38.61,47.42)
LCD_RS: length 61
  Top Layer w0.254: 40.71,58.02 38.41,58.02 37.34,56.95 37.34,40.06 19.02,21.74 LCD.10
LCD_RST: length 68.8
  Top Layer w0.254: LCD.7 19.55,20.24 v1(40.26,40.95) ; v1(36.58,40.95) 36.58,57.33 37.77,58.52 40.58,58.52
  Bottom Layer w0.254: v1(36.58,40.95) v1(40.26,40.95)
LCD_SCL: length 61
  Top Layer w0.254: LCD.9 19.41,21.24 37.97,39.8 37.97,56.69 38.8,57.52 40.71,57.52
LCD_SDA: length 93.6
  Top Layer w0.254: v1(37.47,74.47) 38.61,74.47 40.44,72.64 43.6,72.64 46.09,70.16 46.76,70.16 U1.16 ; LCD.8 3.06,20.74 2.54,21.26 2.54,27.1 4.44,29.01 24,29.01 31.24,36.25 31.24,57.71 v1(36.83,63.3)
  Bottom Layer w0.254: v1(36.83,63.3) 37.47,63.93 v1(37.47,74.47)
M-PWMA: length 35.5
  Top Layer w0.254: U1.64 48.77,53.96 48.77,48.44 49.51,47.7 66.55,47.7 66.55,48.82 67.82,50.09 75.31,50.09 75.57,49.83 TB6612.23
M-PWMB: length 29.9
  Top Layer w0.254: U1.63 48.26,47.8 49.15,46.91 69.47,46.91 70.37,47.81 TB6612.15
NRST: length 67.6
  Top Layer w0.254: v1(45.4,75.17) 46.05,74.53 46.05,70.72 46.23,70.54 47.5,70.54 47.76,70.27 U1.14 ; 97.72,81.52 97.72,79.87 96.9,79.05 93.98,79.05 91.15,76.21 C15.2 84.92,76.25 v1(82.42,76.25)
  Bottom Layer w0.254: v1(45.4,75.17) 45.4,77.46 47.24,79.3 52.2,79.3 55.25,76.25 v1(82.42,76.25)
OSC32_IN: length 7.9
  Top Layer w0.254: U1.8 50.76,70.62 50.8,70.66 51.69,70.66 52.58,71.55 52.58,72.06 52.83,72.31 X3.2 53.85,72.33 53.85,73.71 54.1,73.97 C6.1
OSC32_OUT: length 6
  Top Layer w0.254: C7.1 51.31,73.93 X3.1 50.26,71.26 U1.9
OSC_IN: length 9.7
  Top Layer w0.254: U1.12 48.76,70.66 49.24,71.13 X1.3 50.29,73.28 50.29,77.81 C8.2
OSC_OUT: length 9.8
  Top Layer w0.254: C9.1 47.54,74.43 46.43,73.32 46.43,71.22 46.61,71.04 47.75,71.04 48.26,70.54 U1.13
SDMMC-CD: length 65.6
  Top Layer w0.254: v1(66.68,55.17) 57.78,55.17 56.94,56.02 U1.77 ; v1(62.1,23.16) 60.32,24.94 v1(60.32,35.74) ; v1(72.64,19.74) 72.77,19.86 R4.1
  Bottom Layer w0.254: v1(60.32,35.74) 61.21,35.74 66.68,41.2 v1(66.68,55.17) ; v1(72.64,19.74) 72.64,22.78 72.26,23.16 v1(62.1,23.16)
SDMMC-CLK: length 72.8
  Top Layer w0.254: U1.80 57.85,57.52 58.55,56.82 65.15,56.82 69.34,61.01 82.55,61.01 91.57,51.99 91.57,30.66 85.23,24.32 CARD1.5
SDMMC-CMD: length 75.9
  Top Layer w0.254: 62.99,66.42 62.99,58.75 62.87,58.62 59.07,58.62 58.67,59.02 U1.83 ; CARD1.3 86.41,26.52 88.26,28.37 88.26,54.03 v1(82.42,59.87) ; R7.2 v1(66.04,66.55)
  Bottom Layer w0.254: v1(66.04,66.55) 75.74,66.55 v1(82.42,59.87)
SDMMC-D0: length 67.7
  Top Layer w0.254: 65.05,22.15 52.07,22.15 49.78,24.44 v1(49.78,37.64) ; 65.05,22.15 84.2,22.15 CARD1.7 ; 65.05,22.15 65.08,22.17 R8.2 ; U1.65 49.26,49.47 v1(49.66,49.07)
  Bottom Layer w0.254: v1(49.78,37.64) 49.66,37.77 v1(49.66,49.07)
SDMMC-D1: length 72.1
  Top Layer w0.254: CARD1.8 65.2,21.02 ; 65.2,21.02 65.08,20.89 R9.2 ; 65.2,21.02 50.92,21.02 47.37,24.56 v1(47.37,38.15) ; v1(49.84,50.6) 49.76,50.68 U1.66
  Bottom Layer w0.254: v1(49.84,50.6) 47.62,50.6 47.37,50.34 v1(47.37,38.15)
SDMMC-D2: length 64.7
  Top Layer w0.254: R5.2 84.05,36.32 84.11,36.26 ; 84.11,36.26 84.11,43.01 86.61,45.52 86.61,50.72 85.98,51.36 80.52,51.36 80.34,51.54 80.34,58.27 79.76,58.85 69.22,58.85 66.17,55.8 57.78,55.8 56.94,56.65 56.69,56.65 56.64,56.59 55.88,56.59 U1.78 ; 84.11,36.26 84.11,28.84 CARD1.1
SDMMC-D3: length 73.7
  Top Layer w0.254: R6.2 80.9,27.99 81.27,27.62 CARD1.2 86.61,27.62 86.79,27.8 86.79,44.17 87.63,45.01 87.63,53.14 80.9,59.87 69.34,59.87 65.66,56.19 58.29,56.19 57.46,57.02 U1.79
STATUS_BLE: length 4
  Top Layer w0.254: U1.24 42.76,70.19 42.16,70.79 40.13,70.79
SWCLK: length 36.7
  Top Layer w0.254: v1(60.76,52.81) 60.71,52.76 59.69,52.76 56.93,55.52 U1.76 ; v1(60.76,41.38) 53.02,41.38 52.71,41.07 R17.1
  Bottom Layer w0.254: v1(60.76,41.38) v1(60.76,52.81)
SWDIO: length 28.1
  Top Layer w0.254: U1.72 52.76,51.69 53.34,51.11 55.12,51.11 56.51,49.71 v1(56.51,48.82) ; R18.1 58.77,37.49 v1(58.8,37.52)
  Bottom Layer w0.254: v1(58.8,37.52) 58.8,46.53 v1(56.51,48.82)
UART4_RX: length 55.1
  Top Layer w0.254: H2.3 70.48,95.17 71.7,93.96 73.48,93.96 73.66,93.78 73.66,84.89 68.07,79.3 68.07,60.38 65.28,57.58 58.55,57.58 58.11,58.02 U1.81
UART4_TX: length 54.7
  Top Layer w0.254: U1.82 58.5,58.52 58.93,58.09 63.75,58.09 66.93,61.27 66.93,79.55 72.64,85.27 72.64,92.63 72.14,93.14 69.09,93.14 67.94,94.28 H2.4
UART5_RX: length 67.2
  Top Layer w0.254: U1.51 42.26,32.91 40.77,31.42 37.08,31.42 13.21,7.54 11.68,7.54 H3.3
UART5_TX: length 65.7
  Top Layer w0.254: 10.67,3.99 37.21,30.53 41.4,30.53 42.76,31.89 U1.52
USB-DN: length 38.5
  Top Layer w0.254: R13.2 68.96,31.75 68.96,36.12 66.17,38.91 v1(55.37,38.91) ; U1.70 51.76,50.65 52.58,49.84 53.85,49.84 54.03,49.66 v1(54.03,48.56)
  Bottom Layer w0.254: v1(55.37,38.91) 54.03,40.26 v1(54.03,48.56)
USB-DP: length 36.4
  Top Layer w0.254: U1.71 52.26,51.04 52.96,50.34 54.48,50.34 55.25,49.58 v1(55.25,48.69) ; R14.2 70.36,32.38 70.36,36.75 67.06,40.06 v1(56.31,40.06)
  Bottom Layer w0.254: v1(55.25,48.69) 55.25,41.12 v1(56.31,40.06)
USBC-CC1: length 2.7
  Top Layer w0.254: R10.1 89.06,8.24 USB1.A5
USBC-CC2: length 2.7
  Top Layer w0.254: R11.1 92.05,10.89 USB1.B5
USBC-DN: length 46.8
  Top Layer w0.254: v1(78.99,30.34) D2.1 D2.6 74.15,30.28 R13.1 ; v1(82.8,5.38) 89.15,5.38 89.55,5.78 USB1.B7 89.55,9.33 89.66,9.45 90.3,9.45 90.55,9.19 90.55,8.23 USB1.A7
  Bottom Layer w0.254: v1(78.99,30.34) 79.06,30.28 79.06,15.86 82.8,12.12 v1(82.8,5.38)
USBC-DP: length 60.7
  Top Layer w0.254: 91.05,6.62 91.05,5.77 91.68,5.13 v1(96.27,5.13) ; 91.05,6.62 91.01,6.66 90.3,6.66 90.05,6.91 USB1.A6 ; 91.05,6.62 USB1.B6 ; v1(78.61,32.24) D2.3 D2.4 74.15,32.31 R14.1
  Bottom Layer w0.254: v1(96.27,5.13) 96.27,15.04 94.49,16.81 80.9,16.81 80.01,17.7 80.01,31.67 79.44,32.24 v1(78.61,32.24)
VCAP1: length 12.8
  Top Layer w0.254: 40.71,56.52 39.58,56.52 39.12,56.06 39.12,47.93 39.5,47.55 C13.2
VCAP2: length 7.4
  Top Layer w0.254: C14.2 57.49,52.12 53.72,52.12 53.26,52.58 U1.73
VREF: length 27.5
  Top Layer w0.254: R2.1 36.32,78.03 36.14,77.85 36.14,74.98 35.57,74.41 ; 35.57,74.41 31.62,74.41 ; 35.57,74.41 35.57,73.55 36.83,72.29 43.45,72.29 44.76,70.98 U1.20 ; 31.62,74.41 31.62,73.49 R1.1 ; 31.62,74.41 31.62,75.87 32,76.25 C11.2
VREF-C: length 32.7
  Top Layer w0.254: R2.2 38.03,86.36 v1(35.94,88.44)
  Inner2 w0.254: H4.1 30.48,93.9 v1(35.94,88.44)
$1N2673: length 7.2
  Top Layer w0.254: D1.2 79.79,86.6 U3.2
$1N4458: length 6.1
  Top Layer w0.254: R4.2 78.21,19.92 CARD1.9
$1N6086: length 6.9
  Top Layer w0.254: C17.2 85.06,47.22 83.1,45.26 C16.2
$1N7839: length 51.9
  Top Layer w0.254: v1(52.71,24.56) R17.2
  Bottom Layer w0.254: SWDEBUG.1 16.38,3.73 16.38,7.29 33.66,24.56 v1(52.71,24.56)
$1N7848: length 54.2
  Top Layer w0.254: v1(56.51,24.18) 58.77,26.44 58.77,28.57
  Bottom Layer w0.254: 18.8,3.61 18.8,8.18 33.78,23.16 55.5,23.16 v1(56.51,24.18)
$1N9792: length 15.4
  Top Layer w0.254: D4.1 13.83,76.35 R19.1
$1N9800: length 5
  Top Layer w0.254: D4.2 12.66,90.5 D3.1
$1N9955: length 5.3
  Top Layer w0.254: R20.2 4.86,90.18 D3.2
$1N9971: length 4.5
  Top Layer w0.254: R21.2 8.25,85.14 10.41,85.14 10.8,84.76 C21.1

## Copper pours and planes (outline as drawn; the poured copper is in the pictures)
GND on Top Layer: -11.43,108.25 108.57,108.25 108.57,-11.75 -11.43,-11.75
GND on Bottom Layer: -15.37,109.53 107.44,109.53 107.44,-6.81 -15.37,-6.81
